# Altium schematic sheet BLOCK DIAGRAM.SchDoc
size A; SheetNumber: 2; SheetTotal: 3
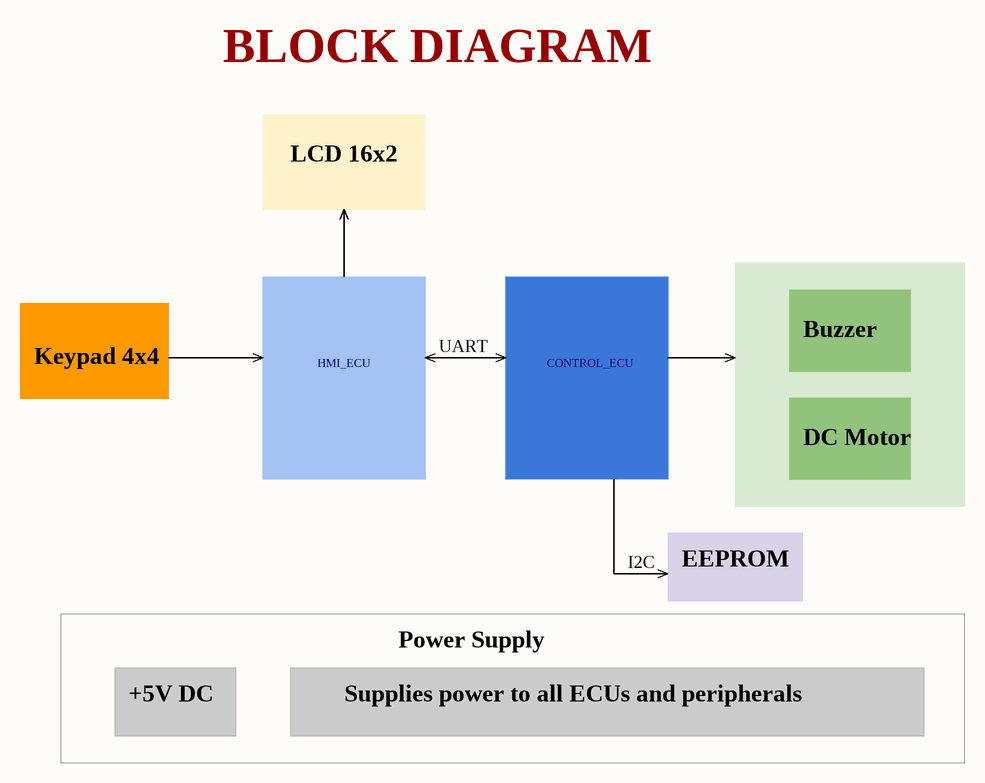
[diagram p0: BLOCK DIAGRAM.SchDoc]

## Sub-sheets
CONTROL_ECU = CONTROL_ECU.SchDoc: no entries
HMI_ECU = HMI_ECU.SchDoc: no entries

## Notes on the sheet
- BLOCK DIAGRAM
- LCD 16x2
- Keypad 4x4
- UART
- Buzzer
- DC Motor
- I2C
- EEPROM
- +5V DC
- Supplies power to all ECUs and peripherals
- Power Supply